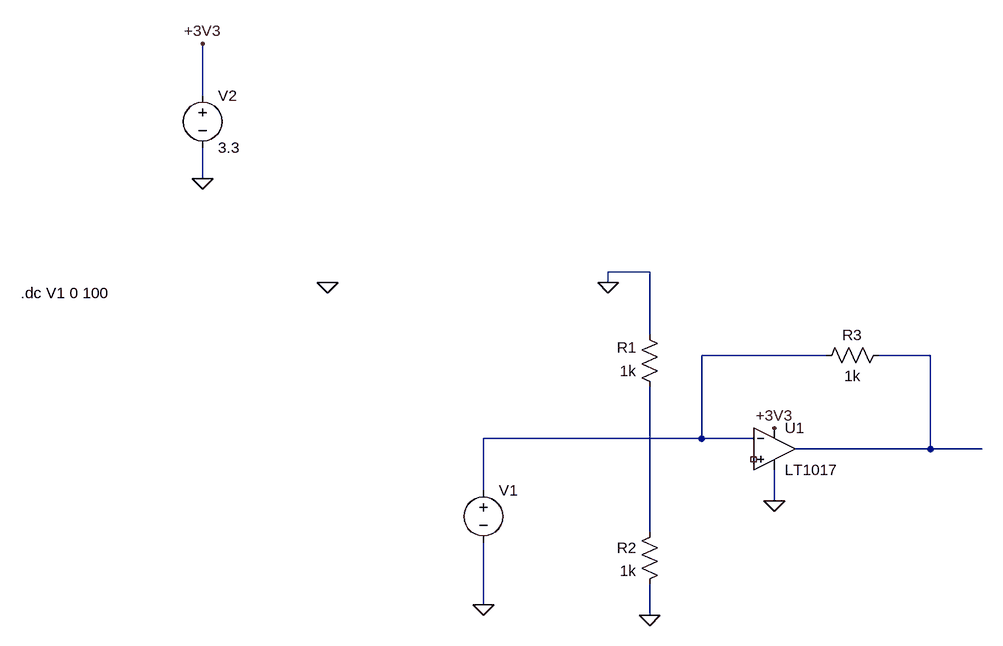
[diagram p0: schematic Draft1.asc]
Draft1.asc, the LTspice schematic file:
Version 4
SHEET 1 1624 680
WIRE 352 -528 352 -608
WIRE 352 -400 352 -448
WIRE 1040 -256 976 -256
WIRE 976 -240 976 -256
WIRE 1040 -160 1040 -256
WIRE 1312 -128 1120 -128
WIRE 1472 -128 1392 -128
WIRE 1120 0 1120 -128
WIRE 1120 0 784 0
WIRE 1200 0 1120 0
WIRE 1472 16 1472 -128
WIRE 1472 16 1264 16
WIRE 1552 16 1472 16
WIRE 784 80 784 0
WIRE 1232 96 1232 48
WIRE 1040 144 1040 -80
WIRE 784 256 784 160
WIRE 1040 272 1040 224
FLAG 544 -240 0
FLAG 784 256 0
FLAG 976 -240 0
FLAG 352 -400 0
FLAG 352 -608 +3V3
FLAG 1232 -16 +3V3
FLAG 1040 272 0
FLAG 1232 96 0
SYMBOL res 1056 -64 R180
WINDOW 0 36 76 Left 2
WINDOW 3 36 40 Left 2
SYMATTR InstName R1
SYMATTR Value 1k
SYMBOL res 1056 128 M0
SYMATTR InstName R2
SYMATTR Value 1k
SYMBOL Comparators\\LT1017 1232 16 R0
SYMATTR InstName U1
SYMBOL voltage 784 64 R0
WINDOW 123 0 0 Left 0
WINDOW 39 0 0 Left 0
SYMATTR InstName V1
SYMATTR Value ""
SYMBOL voltage 352 -544 R0
WINDOW 123 0 0 Left 0
WINDOW 39 0 0 Left 0
SYMATTR InstName V2
SYMATTR Value 3.3
SYMBOL res 1408 -144 R90
WINDOW 0 0 56 VBottom 2
WINDOW 3 32 56 VTop 2
SYMATTR InstName R3
SYMATTR Value 1k
TEXT 72 -224 Left 2 !.dc V1 0 100

The netlist it stands for:
* Draft1.asc
R1 N003 0 1k
R2 N003 0 1k
XU1 NC_01 N001 +3V3 0 N002 LT1017  ; pins In+ In- V+ V- OUT
V1 N001 0
V2 +3V3 0 3.3
R3 N002 N001 1k
.dc V1 0 100
.backanno
.end